# EAGLE design Ponte - ArduUri (EAGLE 6.1)
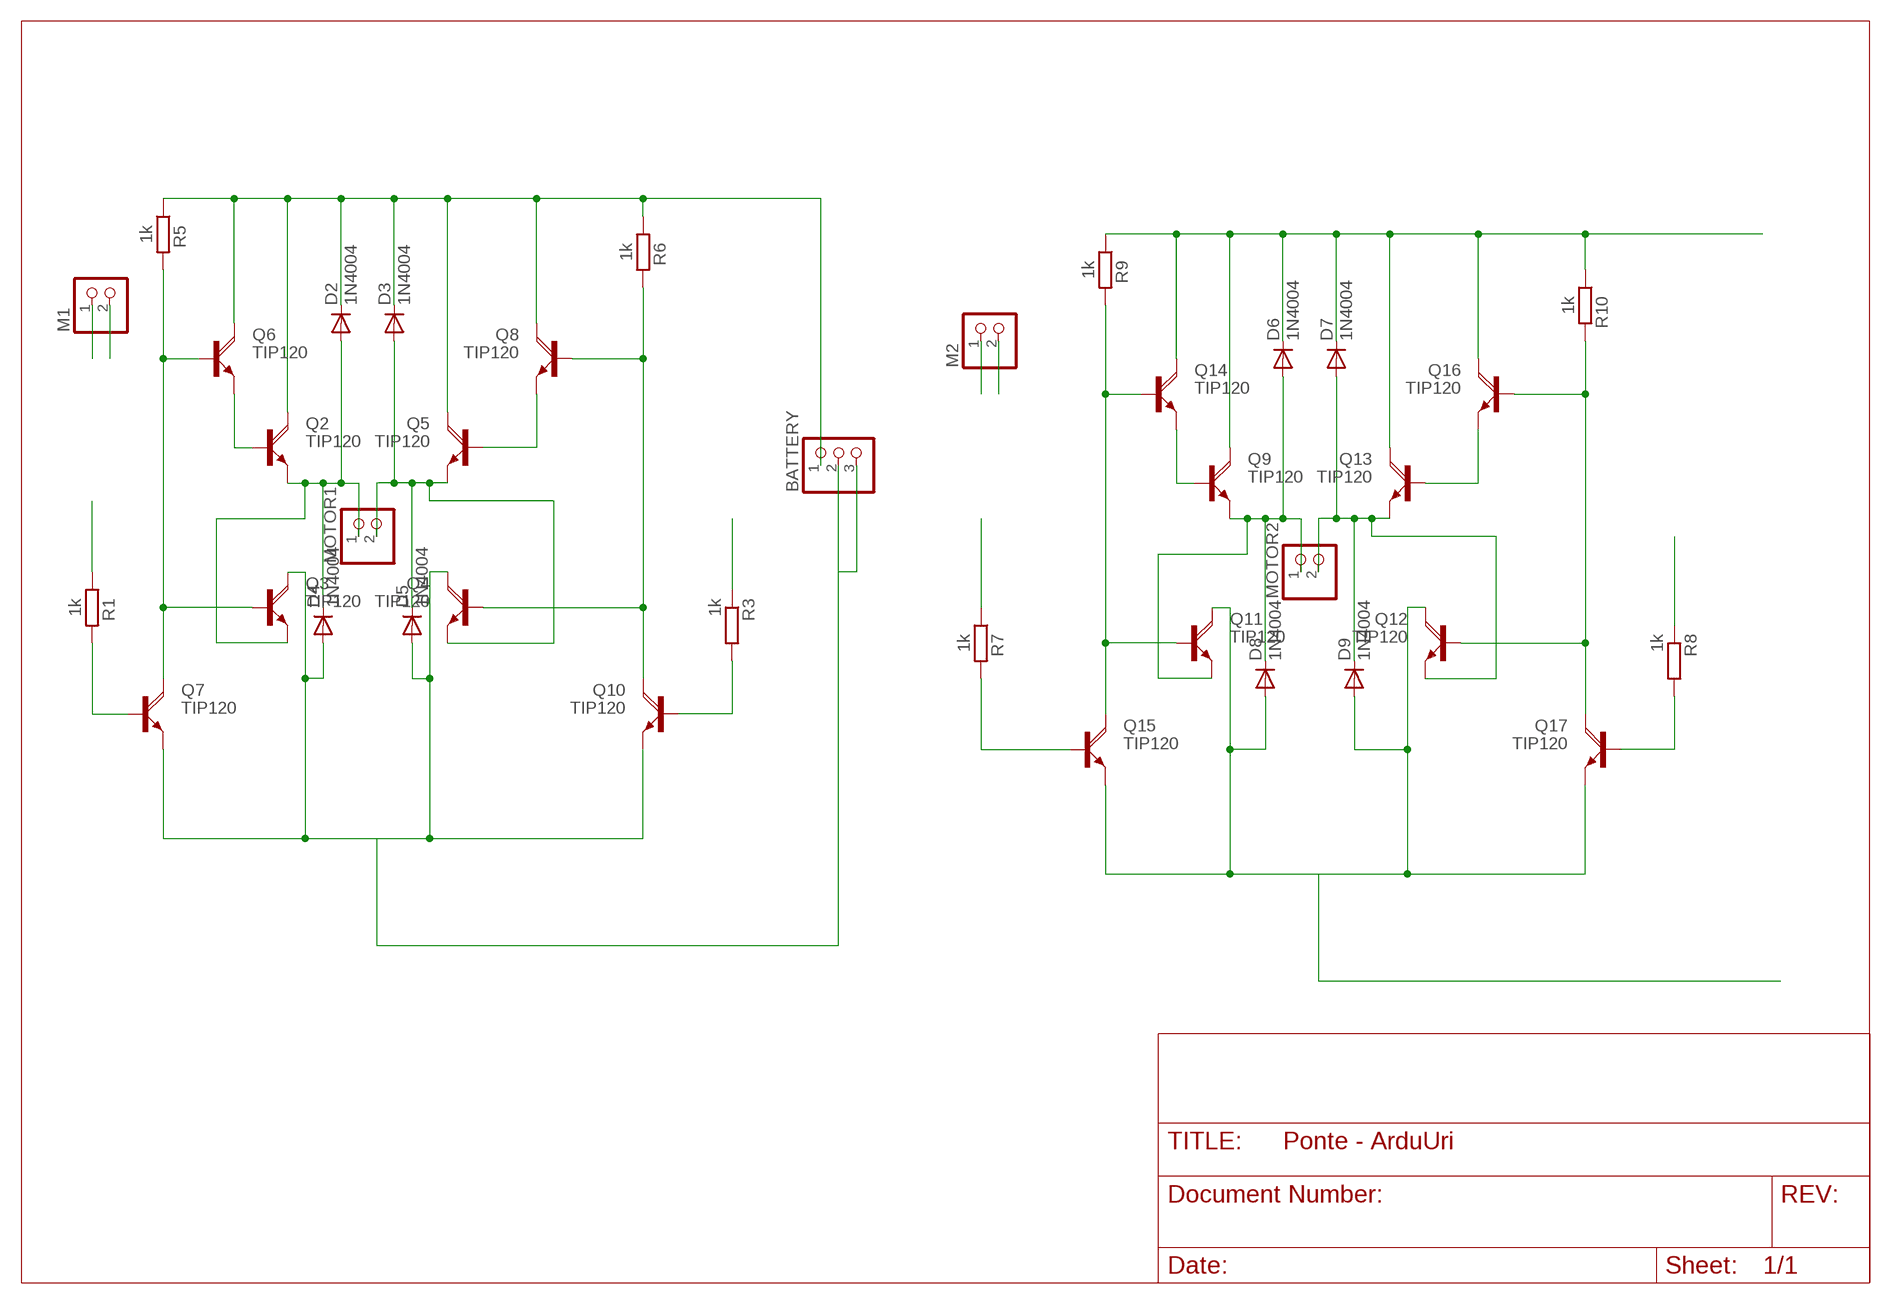
[diagram p0: schematic, sheet 1]

## Parts
BATTERY  PINHD-1X3  [1X03]
D2  1N4004  [DO41-10]
D3  1N4004  [DO41-10]
D4  1N4004  [DO41-10]
D5  1N4004  [DO41-10]
D6  1N4004  [DO41-10]
D7  1N4004  [DO41-10]
D8  1N4004  [DO41-10]
D9  1N4004  [DO41-10]
M1  PINHD-1X2  [1X02]
M2  PINHD-1X2  [1X02]
MOTOR1  PINHD-1X2  [1X02]
MOTOR2  PINHD-1X2  [1X02]
Q2  TIP120  [TO220AH]
Q3  TIP120  [TO220AH]
Q4  TIP120  [TO220AH]
Q5  TIP120  [TO220AH]
Q6  TIP120  [TO220AH]
Q7  TIP120  [TO220AH]
Q8  TIP120  [TO220AH]
Q9  TIP120  [TO220AH]
Q10  TIP120  [TO220AH]
Q11  TIP120  [TO220AH]
Q12  TIP120  [TO220AH]
Q13  TIP120  [TO220AH]
Q14  TIP120  [TO220AH]
Q15  TIP120  [TO220AH]
Q16  TIP120  [TO220AH]
Q17  TIP120  [TO220AH]
R1  1k  R-EU_0204/7  [0204/7]
R3  1k  R-EU_0204/7  [0204/7]
R5  1k  R-EU_0204/7  [0204/7]
R6  1k  R-EU_0204/7  [0204/7]
R7  1k  R-EU_0204/7  [0204/7]
R8  1k  R-EU_0204/7  [0204/7]
R9  1k  R-EU_0204/7  [0204/7]
R10  1k  R-EU_0204/7  [0204/7]

## Nets
GND: BATTERY.2 BATTERY.3 D4.A D5.A D8.A D9.A Q3.C Q4.C Q7.E Q10.E Q11.C Q12.C Q15.E Q17.E
M1-A1: M1.1 R1.1
M1-B1: M1.2 R3.1
M2-A2: M2.1 R7.1
M2-B2: M2.2 R8.1
N$3: Q5.B Q8.E
N$4: Q10.B R3.2
N$7: Q7.B R1.2
N$8: Q2.B Q6.E
N$9: Q9.B Q14.E
N$10: Q3.B Q6.B Q7.C R5.2
N$11: Q4.B Q8.B Q10.C R6.2
N$12: Q13.B Q16.E
N$14: D2.A D4.C MOTOR1.1 Q2.E Q3.E
N$15: D3.A D5.C MOTOR1.2 Q4.E Q5.E
N$17: Q17.B R8.2
N$19: Q15.B R7.2
N$36: Q11.B Q14.B Q15.C R9.2
N$37: Q12.B Q16.B Q17.C R10.2
N$41: D6.A D8.C MOTOR2.1 Q9.E Q11.E
N$42: D7.A D9.C MOTOR2.2 Q12.E Q13.E
VCC-BAT: BATTERY.1 D2.C D3.C D6.C D7.C Q2.C Q5.C Q6.C Q8.C Q9.C Q13.C Q14.C Q16.C R5.1 R6.1 R9.1 R10.1

## Library data of the parts
BATTERY = pinhead:PINHD-1X3: PIN HEADER
D2-D9 = diode:1N4004: DIODE general purpose rectifier, 1 A
M1 M2 MOTOR1 MOTOR2 = pinhead:PINHD-1X2: PIN HEADER
Q2-Q17 = transistor-power:TIP120: NPN DARLINGTON TRANSISTOR
R1 R3 R5-R10 = rcl:R-EU_: RESISTOR, European symbol

## Board
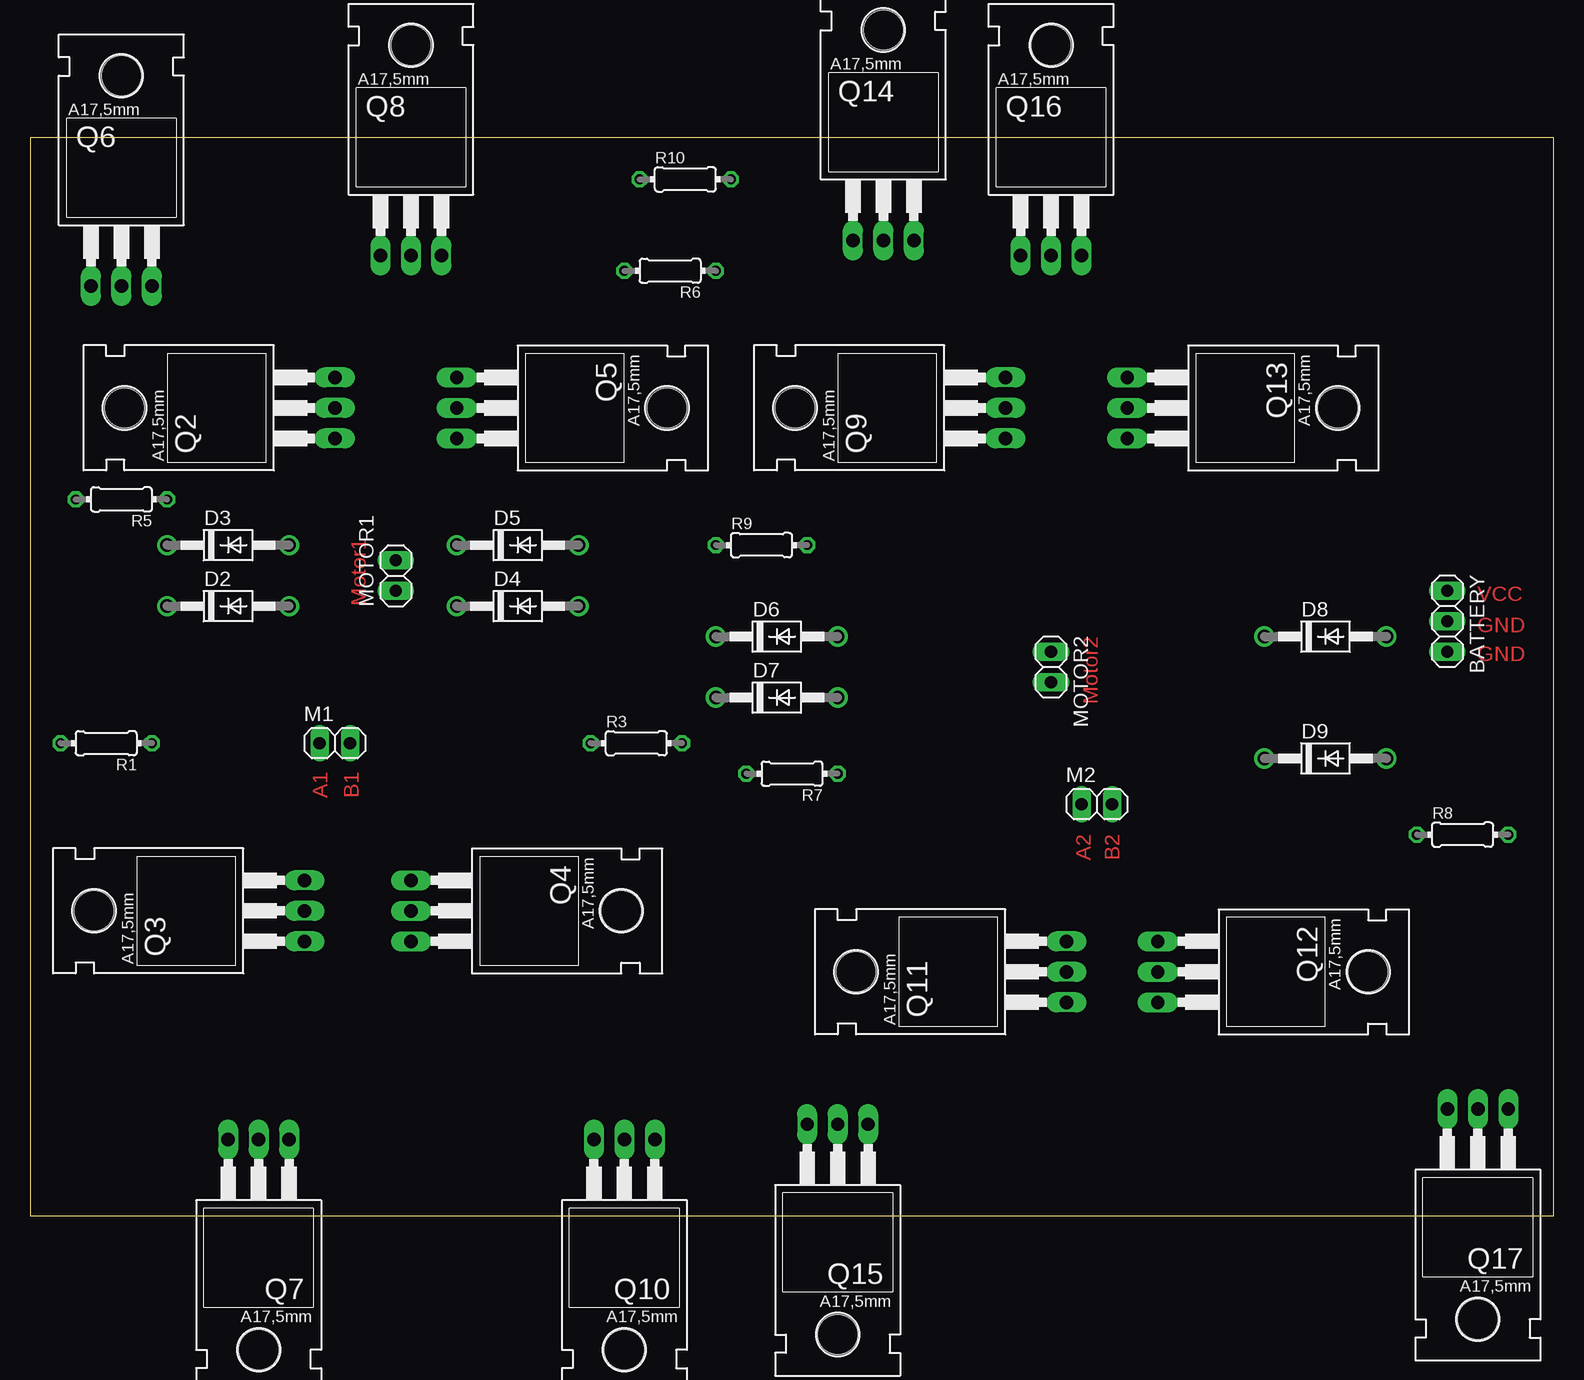
[diagram p1: board, top side]
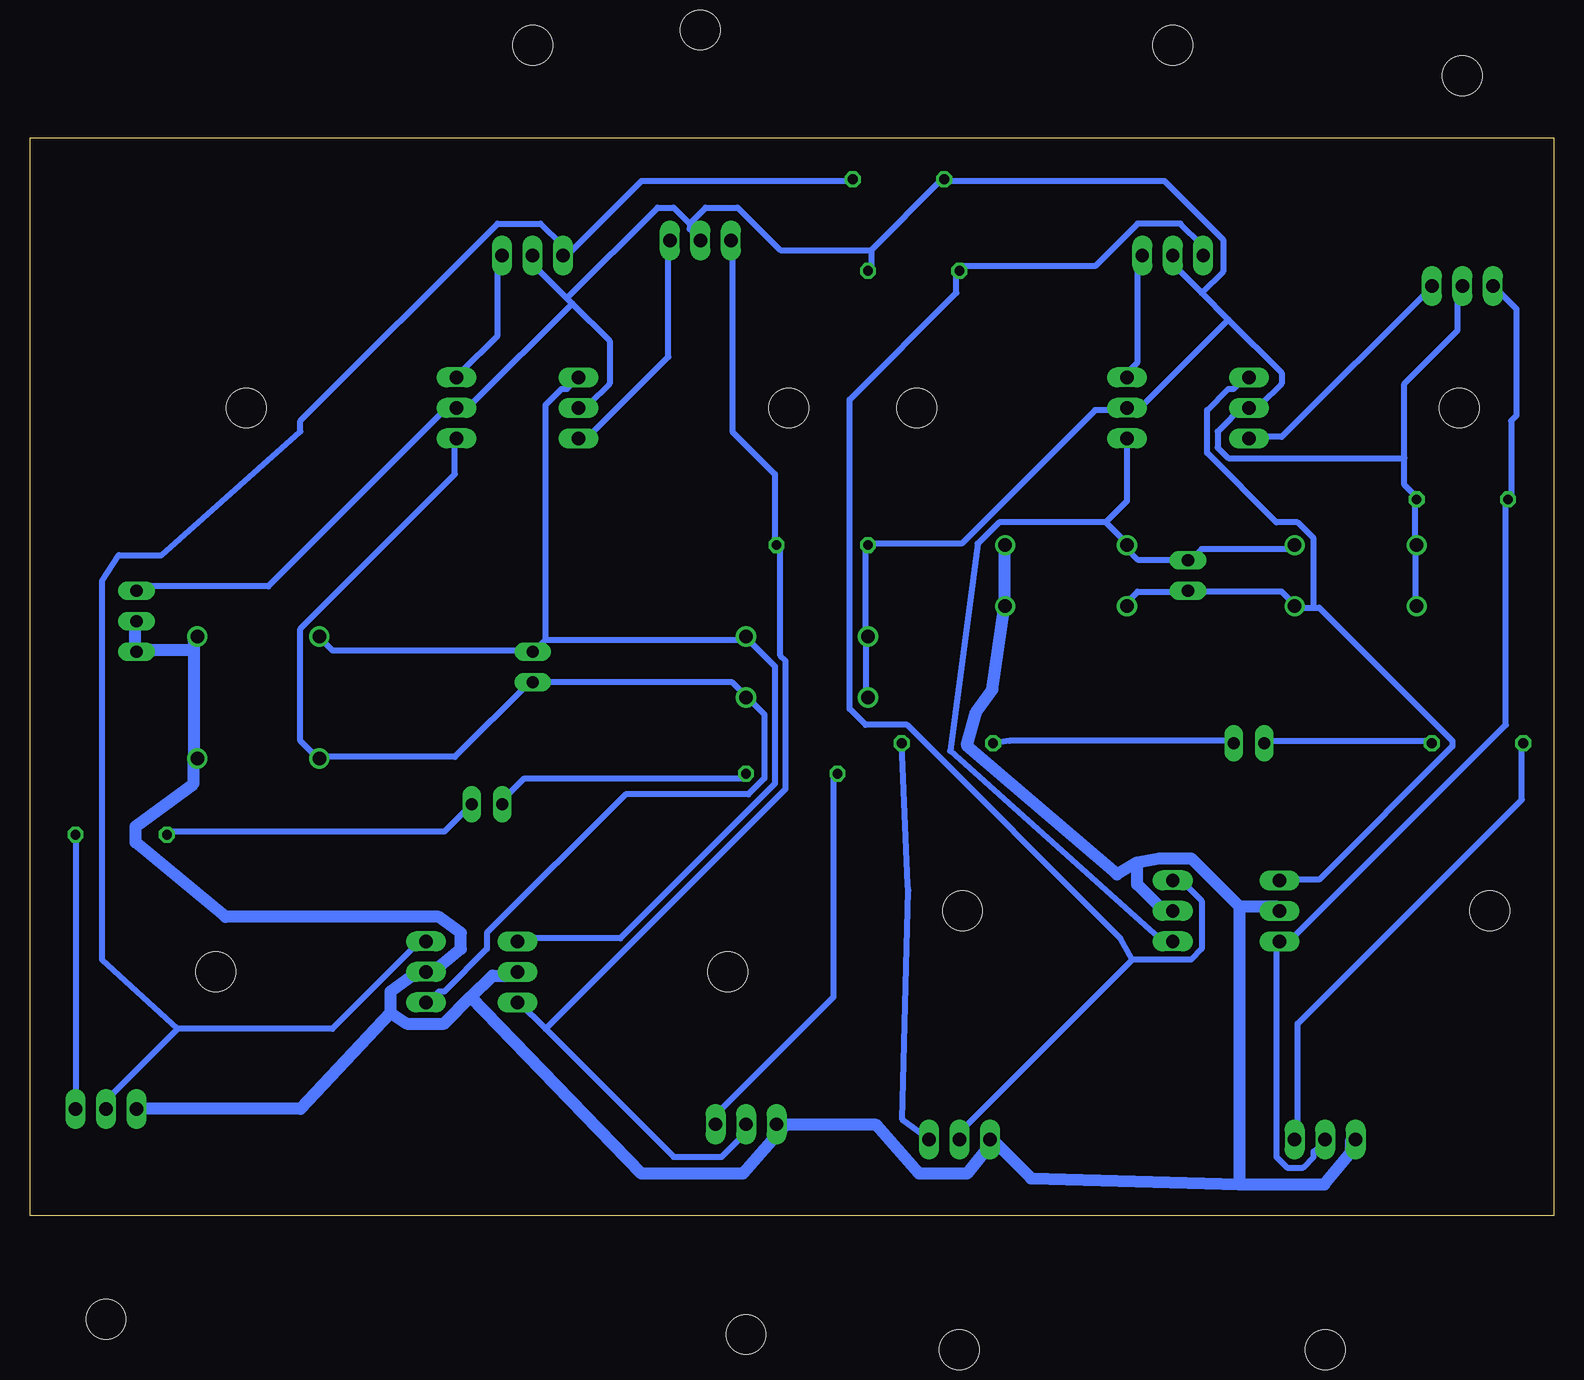
[diagram p2: board, bottom side, seen from below]

Size 126.98 x 89.84 mm. Coordinates in mm from the lower left corner, seen from the top.
Outline: 0,0 126.98,0 126.98,89.84 0,89.84 0,0
Copper layers (1*16): Top 0.035mm / dielectric 1.5mm / Bottom 0.035mm
Design rules "default *": minimum track width 20mil, minimum drill 24mil, track to track 15mil, track to pad 15mil, pad to pad 15mil, via to via 15mil, smd to smd 8mil, copper to edge 40mil, drill to drill 8mil, minimum pad ring 10mil, minimum via ring 8mil, stop-mask expansion 4mil, vias tented up to drill 0mil, thermal gap 10mil

### Footprints (pad centres in the part's own frame; a part is rotated, then mirrored left to right if it is on the bottom)
1X03 = drill 1.016 long: 1 -2.54,0; 2 0,0; 3 2.54,0
DO41-10 = drill 1.118: A 5.08,0; C -5.08,0
1X02 = drill 1.016 long: 1 -1.27,0; 2 1.27,0
TO220AH = drill 1.118 long: B -2.54,-6.35; C 0,-6.35; E 2.54,-6.35 | hole 3.302: 0,11.176
0204/7 = drill 0.813 octagon: 1 -3.81,0; 2 3.81,0

### Placement (x,y rotation side)
BATTERY  118.11,49.53 270 top
D2  16.51,50.8 0 top
D3  16.51,55.88 0 top
D4  40.64,50.8 0 top
D5  40.64,55.88 0 top
D6  62.23,48.26 0 top
D7  62.23,43.18 0 top
D8  107.95,48.26 0 top
D9  107.95,38.1 0 top
M1  25.4,39.37 0 top
M2  88.9,34.29 0 top
MOTOR1  30.48,53.34 90 top
MOTOR2  85.09,45.72 270 top
Q2  19.05,67.31 90 top
Q3  16.51,25.4 90 top
Q4  38.1,25.4 270 top
Q5  41.91,67.31 270 top
Q6  7.62,83.82 0 top
Q7  19.05,0 180 top
Q8  31.75,86.36 0 top
Q9  74.93,67.31 90 top
Q10  49.53,0 180 top
Q11  80.01,20.32 90 top
Q12  100.33,20.32 270 top
Q13  97.79,67.31 270 top
Q14  71.12,87.63 0 top
Q15  67.31,1.27 180 top
Q16  85.09,86.36 0 top
Q17  120.65,2.54 180 top
R1  6.35,39.37 180 top
R3  50.53,39.37 0 top
R5  7.62,59.69 180 top
R6  53.34,78.74 180 top
R7  63.5,36.83 180 top
R8  119.38,31.75 0 top
R9  60.96,55.88 0 top
R10  54.61,86.36 0 top

### Tracks (layer width: path | path; a pad name or v marks a point on that pad's centre or on a via)
GND
  Bottom 0.508: 118.24,47.12 BATTERY.3 117.79,47.12 | 118.24,49.34 BATTERY.2 | 113.35,38.23 D9.A | 113.35,48.01 D8.A | 95.12,20 94.23,20 Q12.C | 86.68,20 Q11.C | 64.01,7.56 64.45,7.56 Q15.E | 46.67,6.22 Q10.E | 45.78,51.12 D4.A 45.78,50.67 | 45.78,55.56 D5.A | 32,25.78 32.89,25.78
  Bottom 1.016: 118.24,49.34 118.24,47.12 | 113.35,48.01 113.35,47.12 | 113.35,47.12 113.35,38.23 | 113.35,47.12 117.79,47.12 | 86.68,20 88.46,20 90.23,18.22 | 90.23,18.22 92.46,16 95.57,16 96.96,16.89 | 96.96,16.89 96.96,18.67 95.12,20 | Q17.E 104.46,8.89 96.96,16.89 | D9.A 113.35,37.78 113.35,36.01 118.17,32.45 118.17,31.11 110.68,24.89 92.9,24.89 91.07,23.56 91.07,22.23 93.79,20 Q12.C | 26.23,2.61 43.56,3.11 46.67,6.22 48.9,3.5 52.9,3.5 56.45,7.56 64.01,7.56 | 26.23,2.61 19.11,2.61 16.89,5.33 16.89,6.22 Q7.E | 45.78,55.56 45.78,51.12 | 26.23,25.78 23.11,25.78 Q3.C | 26.23,25.78 30.23,29.78 32.89,29.78 34.73,29.45 | 34.73,29.45 34.73,27.61 32.89,25.78 | 32,25.78 Q4.C | 45.78,50.67 46.78,43.84 48.12,42.01 48.92,39.17 36.39,28.45 34.73,29.45 | 26.23,25.78 26.23,2.61 | 90.23,18.22 76.01,3.5 67.56,3.5 64.01,7.56 | 64.01,7.56 Q15.E
M1-A1
  Bottom 0.508: R1.1 10.22,39.56 24,39.56 M1.1
M1-B1
  Bottom 0.508: R3.1 45.34,39.56 26.67,39.56 M1.2
M2-A2
  Bottom 0.508: R7.1 67.56,36.45 85.79,36.45 87.57,34.67 M2.1
M2-B2
  Bottom 0.508: M2.2 92.46,32 115.57,32 R8.1
N$3
  Bottom 0.508: Q8.E 34.67,80.01 34.67,71.12 35.56,70.23 Q5.B
N$4
  Bottom 0.508: R3.2 53.84,27.56 53.78,27.11 54.28,8 52.45,6.67 Q10.B
N$7
  Bottom 0.508: R1.2 2.67,39.12 2.67,34.67 21.34,16 21.34,6.67 Q7.B
N$8
  Bottom 0.508: Q2.B 25.34,64.9 22.67,64.9 10.22,77.34 Q6.E
N$9
  Bottom 0.508: Q14.E 73.79,80.9 73.79,71.56 80.9,64.45 Q9.B
N$10
  Bottom 0.508: Q6.B 4.89,77.34 3.11,75.56 3.11,66.67 3.56,66.23 3.56,60.01 R5.2 4,59.56 4,40.89 21.78,23.11 22.67,23.11 Q3.B 23.11,22.67 23.11,4.89 22.23,4 20.89,4 20,4.89 20,5.33 19.11,6.22 Q7.C
N$11
  Bottom 0.508: Q8.B 29.34,80.01 29.34,80.9 31.11,82.68 34.67,82.68 38.23,79.12 49.34,79.12 R6.2 49.78,78.68 49.78,76.9 58.67,68.01 58.67,42.23 57.34,40.89 53.9,40.89 36.12,23.11 35.12,21.34 | 35.12,21.34 49.34,7.11 49.34,6.67 Q10.C | 35.12,21.34 30.23,21.34 29.34,22.23 29.34,26.23 30.67,27.56 31.56,27.56 Q4.B
N$12
  Bottom 0.508: Q16.E 88.01,80.01 88.01,73.34 91.12,70.23 Q13.B
N$14
  Bottom 0.508: D4.C 35.56,51.12 34.67,52.01 30.67,52.01 MOTOR1.1 30.23,52.01 22.67,52.01 21.78,51.12 D2.A 21.34,50.67 20,50.67 | 20,50.67 19.56,50.67 8.45,39.56 8.45,39.12 19.56,28 22.67,28 Q3.E | 20,50.67 20,56.45 21.34,57.78 23.11,57.78 28.89,63.56 28.89,67.12 27.11,68.9 26.67,68.9 25.78,69.79 Q2.E
N$15
  Bottom 0.508: 37.34,57.78 46.23,57.78 48.01,56.01 50.31,38.73 32.89,23.11 32,23.11 Q4.E | 37.34,57.78 35.56,56.01 D5.C 35.56,55.56 34.67,54.67 30.67,54.67 MOTOR1.2 30.23,54.67 29.34,55.56 21.78,55.56 D3.A | Q5.E 35.56,59.56 37.34,57.78
N$17
  Bottom 0.508: R8.2 123.13,31.56 123.13,8.89 Q17.B
N$19
  Bottom 0.508: R7.2 60.01,36.45 60.01,18.22 70.23,8 Q15.B
N$36
  Bottom 0.508: Q14.B 68.45,80.9 68.45,65.34 64.9,61.78 64.9,56.01 R9.2 64.45,55.56 64.45,46.67 64.01,46.23 64.01,35.56 84.01,15.56 | 84.01,15.56 86.23,17.78 Q11.B | 84.01,15.56 73.34,4.89 69.34,4.89 67.56,6.67 67.56,7.56 Q15.C
N$37
  Bottom 0.508: R10.2 58.67,86.23 76.01,86.23 82.23,80.01 Q16.B 82.68,80.01 82.68,80.9 84.45,82.68 88.01,82.68 104.46,66.23 104.46,65.34 116.01,55.05 119.57,55.05 120.96,52.9 120.96,21.34 114.68,15.56 | 114.68,15.56 120.46,9.78 120.46,8.89 Q17.C | 114.68,15.56 101.79,15.56 94.23,23.11 Q12.B
N$41
  Bottom 0.508: D8.C 102.68,48.01 101.79,47.12 85.34,47.12 MOTOR2.1 84.9,47.12 84.01,48.01 | 84.01,48.01 67.56,48.01 D6.A 67.12,48.01 64.9,45.78 64.9,36.01 77.79,23.11 86.23,23.11 Q11.E | Q9.E 82.23,68.9 82.68,68.9 84.01,67.56 84.01,48.01
N$42
  Bottom 0.508: Q12.E 93.79,17.78 92.9,18.67 92.46,18.67 88.9,22.23 88.9,23.56 77.34,35.12 67.12,35.12 65.79,36.45 65.79,41.78 67.12,43.12 D7.A 67.56,43.56 68.45,44.45 MOTOR2.2 85.34,44.45 91.57,38.23 102.68,38.23 D9.C 103.12,38.23 104.46,39.56 104.46,48.9 91.57,61.78 91.57,64.45 Q13.E
VCC-BAT
  Bottom 0.508: D2.C 11.56,51.12 11.56,55.56 D3.C 11.56,56.01 11.56,59.56 R5.1 11.56,60.01 12.45,60.9 12.45,63.12 | 12.45,63.12 12.45,69.34 8,73.79 8,77.34 Q6.C | D7.C 57.34,43.56 57.34,48.01 D6.C 57.34,48.45 57.34,55.56 R9.1 56.9,56.01 49.34,56.01 38.23,67.12 35.56,67.12 Q5.C 35.56,67.56 34.23,67.56 27.11,74.68 | 29.34,76.9 31.56,79.12 31.56,80.01 Q8.C | 29.34,76.9 27.11,74.68 | 27.11,74.68 22.67,70.23 22.67,69.34 24.45,67.56 25.34,67.56 Q2.C 25.78,67.56 28,65.34 28,64.01 27.11,63.12 12.45,63.12 | BATTERY.1 117.79,52.45 107.12,52.45 92.46,67.12 91.57,67.12 Q13.C 91.12,67.56 90.23,67.56 81.79,76.01 | 56.9,80.45 56.9,79.12 R6.1 | 56.9,80.45 51.12,86.23 R10.1 50.67,86.23 32.45,86.23 27.56,81.34 27.56,78.68 29.34,76.9 | 82.23,76.45 84.9,79.12 84.9,80.01 Q16.C | 82.23,76.45 81.79,76.01 | 81.79,76.01 78.68,72.9 78.68,69.34 80.45,67.56 80.9,67.56 Q9.C | 72.01,82.68 72.01,82.23 71.12,81.34 Q14.C | 72.01,82.68 73.34,84.01 74.68,84.01 82.23,76.45 | 56.9,80.45 64.45,80.45 68.01,84.01 70.67,84.01 72.01,82.68

### Text on the board
Top: Motor1 | VCC | GND | GND | Motor2 | A1 | B1 | A2 | B2